# EAGLE design badge_spacehuhn (EAGLE 7.6.0)
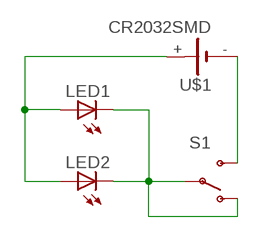
[diagram p0: schematic, sheet 1]

## Parts
LED1  LED5MM  [LED5MM]
LED2  LED5MM  [LED5MM]
S1  SWITCH-SPDT-SMD-A  [SWITCH-SPST-SMD-A]
U$1  CR2032SMD  [CR2032SMD]

## Nets
GND: LED1.K(C) LED2.K(C) S1.1(O) S1.2(P)
N$3: S1.3(S) U$1.-
VCC: LED1.A LED2.A U$1.+

## Library data of the parts
LED1 LED2 = led:LED: LED OSRAM: - CHIPLED LG R971, LG N971, LY N971, LG Q971, LY Q971, LO R971, LY R971 LH N974, LH R974 LS Q976, LO Q976, LY Q976 LO Q996 - Hyper CHIPLED LW Q18S LB Q993, LB Q99A, LB R99A - SideLED LS A670, LO A670, LY A670, LG A670, LP A670 LB A673, LV A673, LT A673, LW A673 LH A674 LY A675 LS A676, LA A676, LO A676, LY A676, LW A676 LS A679, LY A679, LG A679 - Hyper Micro SIDELED® LS Y876, LA Y876, LO Y876, LY Y876 LT Y87S - SmartLED LW L88C, LW L88S LB L89C, LB L89S, LG L890 LS L89K, LO L89K, LY L89K LS L896, LA L896, LO L896, LY L896 - TOPLED LS T670, LO T670, LY T670, LG T670, LP T670 LSG T670, LSP T670, LSY T670, LOP T670, LYG T670 LG T671, LOG T671, LSG T671 LB T673, LV T673, LT T673, LW T673 LH T674 LS T676, LA T676, LO T676, LY T676, LB T676, LH T676, LSB T676, LW T676 LB T67C, LV T67C, LT T67C, LS T67K, LO T67K, LY T67K, LW E67C LS E67B, LA E67B, LO E67B, LY E67B, LB E67C, LV E67C, LT E67C LW T67C LS T679, LY T679, LG T679 LS T770, LO T770, LY T770, LG T770, LP T770 LB T773, LV T773, LT T773, LW T773 LH T774 LS E675, LA E675, LY E675, LS T675 LS T776, LA T776, LO T776, LY T776, LB T776 LHGB T686 LT T68C, LB T68C - Hyper Mini TOPLED® LB M676 - Mini TOPLED Santana® LG M470 LS M47K, LO M47K, LY M47K Source: http://www.osram.convergy.de LUXEON: - LUMILED® LXK2-PW12-R00, LXK2-PW12-S00, LXK2-PW14-U00, LXK2-PW14-V00 LXK2-PM12-R00, LXK2-PM12-S00, LXK2-PM14-U00 LXK2-PE12-Q00, LXK2-PE12-R00, LXK2-PE12-S00, LXK2-PE14-T00, LXK2-PE14-U00 LXK2-PB12-K00, LXK2-PB12-L00, LXK2-PB12-M00, LXK2-PB14-N00, LXK2-PB14-P00, LXK2-PB14-Q00 LXK2-PR12-L00, LXK2-PR12-M00, LXK2-PR14-Q00, LXK2-PR14-R00 LXK2-PD12-Q00, LXK2-PD12-R00, LXK2-PD12-S00 LXK2-PH12-R00, LXK2-PH12-S00 LXK2-PL12-P00, LXK2-PL12-Q00, LXK2-PL12-R00 Source: www.luxeon.com KINGBRIGHT: KA-3528ASYC Source: www.kingbright.com
S1 = SparkFun-Electromechanical:SWITCH-SPDT: SPDT Switch Simple slide switch, Spark Fun Electronics SKU : COM-00102 DPDT SMT slide switch, AYZ0202, SWCH-08179
U$1 = battery:CR2032SMD

## Board
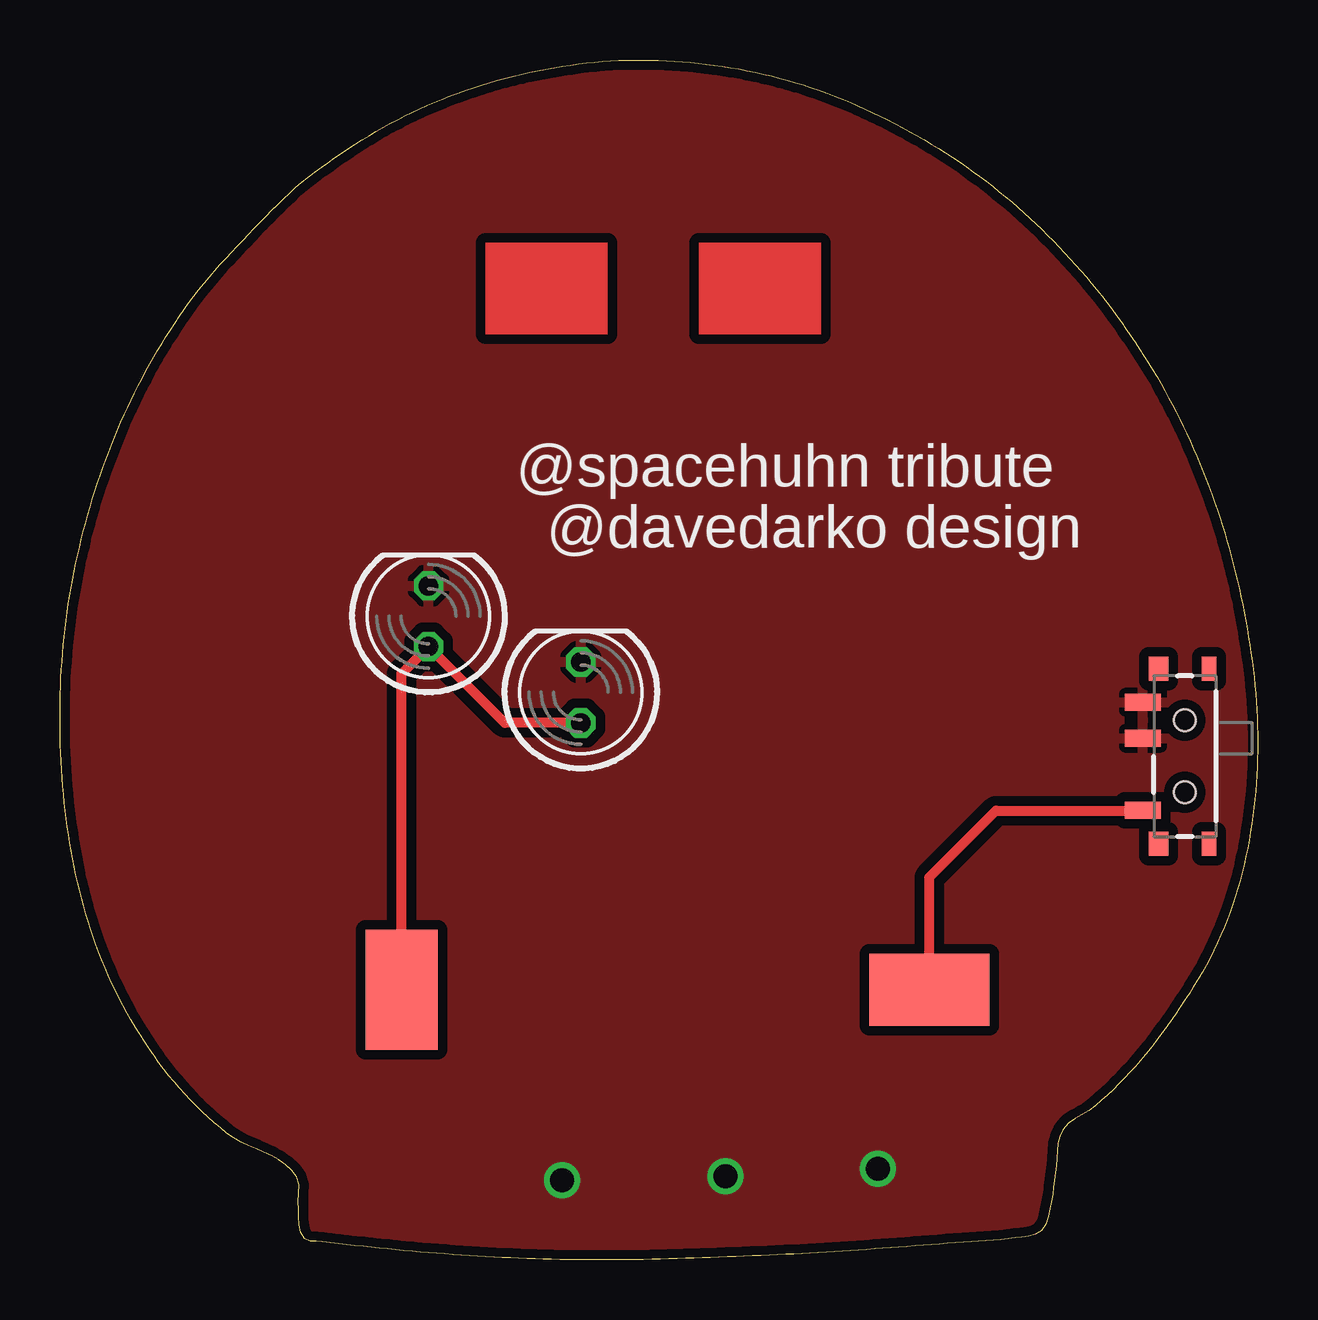
[diagram p1: board, top side]
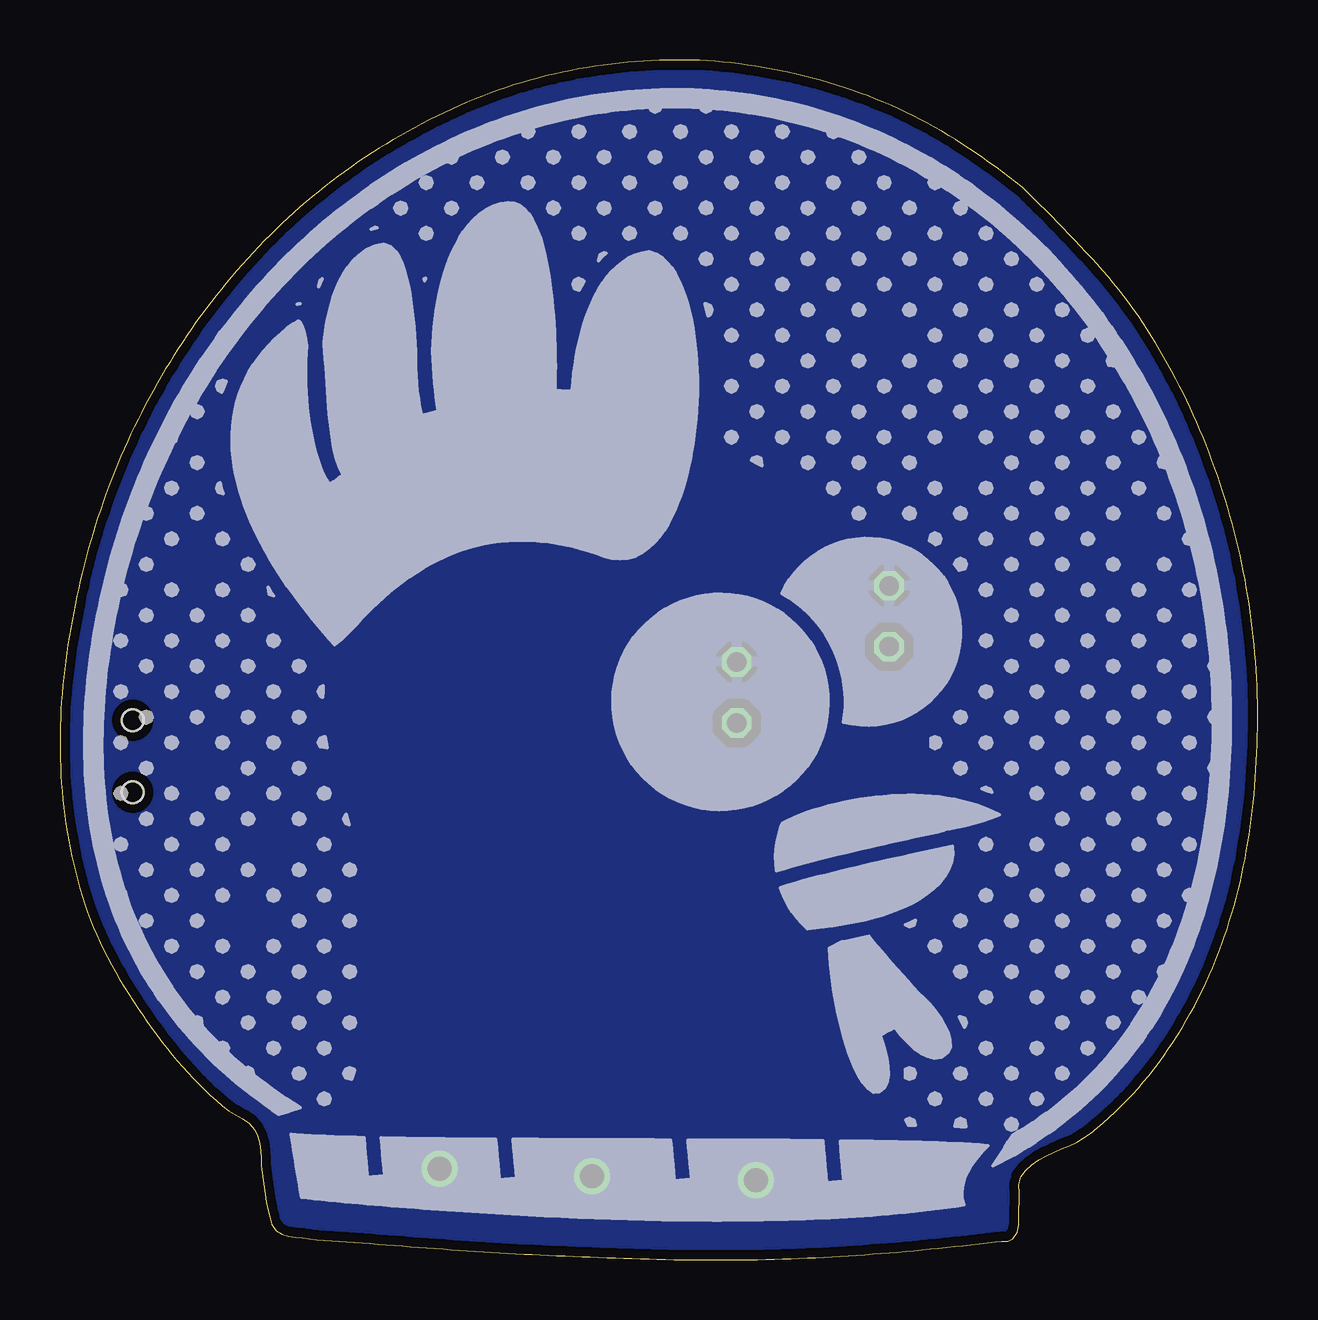
[diagram p2: board, bottom side, seen from below]

Size 49.92 x 50 mm. Coordinates in mm from the lower left corner, seen from the top.
Outline: 9.81,44.7 10.08,44.91 10.35,45.12 10.62,45.32 10.9,45.52 11.17,45.72 11.45,45.92 11.73,46.11 12.02,46.3 12.3,46.49 12.59,46.67 12.88,46.85 13.17,47.02 13.47,47.19 13.76,47.36 14.06,47.52 14.37,47.67 14.67,47.82 14.98,47.97 15.29,48.11 15.61,48.24 15.93,48.37 16.25,48.5 16.58,48.62 16.9,48.74 17.23,48.85 17.56,48.95 17.89,49.05 18.23,49.15 18.56,49.24 18.9,49.33 19.23,49.41 19.57,49.48 19.91,49.55 20.25,49.62 20.59,49.68 20.93,49.74 21.27,49.79 21.62,49.84 21.95,49.88 22.28,49.91 22.61,49.94 22.94,49.96 23.28,49.98 23.61,49.99 23.94,50 24.28,50 24.61,50 24.94,49.99 25.27,49.97 25.61,49.95 25.94,49.93 26.27,49.9 26.6,49.87 26.94,49.83 27.27,49.79 27.61,49.74 27.95,49.68 28.3,49.62 28.64,49.56 28.98,49.49 29.32,49.42 29.66,49.33 30,49.25 30.33,49.16 30.67,49.06 31,48.96 31.33,48.85 31.66,48.74 31.99,48.62 32.31,48.49 32.63,48.36 32.95,48.23 33.27,48.09 33.58,47.95 33.9,47.8 34.21,47.65 34.52,47.5 34.82,47.34 35.13,47.18 35.43,47.02 35.73,46.85 36.03,46.67 36.33,46.5 36.62,46.32 36.91,46.13 37.2,45.94 37.49,45.75 37.77,45.55 38.05,45.35 38.33,45.15 38.61,44.94 38.88,44.73 39.14,44.52 39.41,44.3 39.67,44.09 39.92,43.86 40.18,43.64 40.43,43.41 40.68,43.18 40.92,42.94 41.16,42.7 41.4,42.46 41.64,42.22 41.87,41.97 42.1,41.72 42.33,41.47 42.55,41.22 42.78,40.96 42.99,40.7 43.21,40.43 43.42,40.17 43.63,39.9 43.84,39.63 44.04,39.36 44.24,39.08 44.43,38.81 44.62,38.53 44.81,38.25 45,37.97 45.18,37.68 45.36,37.39 45.54,37.1 45.71,36.81 45.88,36.52 46.04,36.23 46.21,35.93 46.37,35.63 46.52,35.33 46.67,35.03 46.82,34.72 46.97,34.42 47.11,34.11 47.25,33.8 47.38,33.49 47.52,33.18 47.64,32.87 47.77,32.55 47.89,32.23 48.01,31.91 48.12,31.59 48.24,31.27 48.34,30.94 48.45,30.62 48.55,30.29 48.64,29.97 48.74,29.64 48.83,29.31 48.91,28.98 49,28.64 49.07,28.31 49.15,27.98 49.22,27.65 49.29,27.31 49.36,26.98 49.42,26.64 49.48,26.3 49.54,25.97 49.59,25.63 49.64,25.29 49.69,24.95 49.73,24.62 49.77,24.28 49.81,23.94 49.84,23.6 49.86,23.26 49.88,22.92 49.9,22.58 49.91,22.24 49.92,21.9 49.92,21.56 49.92,21.23 49.91,20.89 49.9,20.55 49.88,20.21 49.86,19.87 49.83,19.53 49.8,19.19 49.76,18.85 49.72,18.51 49.67,18.17 49.62,17.83 49.56,17.49 49.5,17.16 49.43,16.82 49.36,16.48 49.28,16.15 49.19,15.82 49.1,15.49 49,15.16 48.89,14.83 48.78,14.51 48.66,14.19 48.53,13.87 48.39,13.55 48.25,13.23 48.1,12.91 47.94,12.6 47.77,12.29 47.6,11.99 47.43,11.68 47.25,11.38 47.06,11.09 46.87,10.79 46.68,10.5 46.48,10.21 46.28,9.93 46.08,9.64 45.87,9.36 45.66,9.08 45.46,8.82 45.25,8.56 45.04,8.31 44.82,8.06 44.59,7.81 44.37,7.57 44.13,7.34 43.9,7.1 43.66,6.87 43.41,6.65 43.17,6.43 42.89,6.23 42.6,6.06 42.3,5.89 42.03,5.69 41.81,5.44 41.68,5.16 41.6,4.86 41.57,4.55 41.55,4.24 41.53,3.93 41.49,3.63 41.45,3.33 41.42,3.03 41.38,2.73 41.33,2.43 41.27,2.14 41.19,1.82 41.09,1.5 40.9,1.23 40.66,1.08 40.39,0.99 40.1,0.95 39.82,0.93 39.53,0.89 39.22,0.85 38.91,0.82 38.6,0.8 38.29,0.78 37.98,0.76 37.67,0.74 37.33,0.71 36.99,0.69 36.66,0.66 36.32,0.64 35.98,0.61 35.65,0.58 35.31,0.56 34.97,0.53 34.64,0.51 34.3,0.48 33.96,0.46 33.62,0.43 33.29,0.41 32.95,0.39 32.61,0.36 32.28,0.34 31.94,0.32 31.6,0.3 31.26,0.28 30.93,0.26 30.59,0.25 30.25,0.23 29.91,0.21 29.56,0.2 29.22,0.18 28.87,0.17 28.52,0.16 28.17,0.14 27.82,0.13 27.47,0.11 27.12,0.1 26.77,0.09 26.43,0.08 26.08,0.06 25.73,0.05 25.38,0.04 25.03,0.03 24.68,0.03 24.33,0.02 23.98,0.01 23.63,0.01 23.29,0 22.94,0 22.59,0 22.24,0 21.89,0 21.54,0 21.19,0.01 20.84,0.01 20.49,0.02 20.14,0.03 19.8,0.04 19.46,0.06 19.12,0.07 18.77,0.08 18.43,0.1 18.09,0.12 17.75,0.14 17.41,0.16 17.06,0.18 16.72,0.2 16.38,0.23 16.04,0.25 15.7,0.28 15.35,0.3 15.01,0.33 14.67,0.36 14.33,0.39 13.99,0.43 13.65,0.46 13.31,0.49 12.97,0.53 12.63,0.57 12.29,0.6 11.95,0.64 11.61,0.68 11.27,0.72 10.92,0.76 10.67,0.77 10.42,0.78 10.2,0.89 10.03,1.16 9.96,1.47 9.95,1.79 9.95,2.11 9.94,2.44 9.94,2.78 9.96,3.13 9.87,3.46 9.66,3.74 9.41,3.97 9.12,4.17 8.81,4.34 8.5,4.49 8.18,4.62 7.86,4.76 7.54,4.92 7.24,5.09 6.95,5.29 6.69,5.5 6.43,5.73 6.18,5.95 5.93,6.19 5.68,6.42 5.44,6.66 5.21,6.91 4.98,7.16 4.76,7.42 4.54,7.68 4.33,7.95 4.12,8.22 3.92,8.51 3.72,8.79 3.52,9.09 3.33,9.38 3.15,9.68 2.97,9.98 2.8,10.29 2.63,10.6 2.47,10.91 2.31,11.22 2.16,11.54 2.02,11.86 1.88,12.18 1.74,12.51 1.61,12.83 1.5,13.15 1.38,13.46 1.28,13.78 1.17,14.1 1.08,14.43 0.98,14.75 0.9,15.07 0.81,15.4 0.73,15.73 0.66,16.06 0.59,16.38 0.53,16.71 0.47,17.05 0.41,17.38 0.36,17.71 0.31,18.04 0.26,18.38 0.22,18.71 0.19,19.06 0.15,19.4 0.12,19.74 0.09,20.09 0.07,20.44 0.05,20.78 0.03,21.13 0.02,21.47 0.01,21.82 0,22.16 0,22.51 0,22.86 0.01,23.2 0.01,23.55 0.03,23.9 0.04,24.24 0.06,24.59 0.08,24.93 0.11,25.28 0.14,25.62 0.18,25.97 0.21,26.31 0.26,26.65 0.3,26.99 0.35,27.34 0.41,27.67 0.47,28.01 0.53,28.35 0.59,28.69 0.66,29.03 0.74,29.36 0.81,29.7 0.89,30.03 0.98,30.37 1.07,30.7 1.16,31.03 1.25,31.36 1.35,31.69 1.46,32.02 1.56,32.35 1.67,32.67 1.79,33 1.9,33.32 2.02,33.64 2.15,33.96 2.27,34.28 2.4,34.59 2.54,34.9 2.67,35.21 2.82,35.52 2.96,35.82 3.11,36.12 3.26,36.43 3.42,36.73 3.58,37.02 3.74,37.32 3.91,37.62 4.08,37.91 4.25,38.2 4.43,38.48 4.61,38.77 4.79,39.05 4.98,39.33 5.17,39.61 5.37,39.89 5.58,40.17 5.79,40.44 6.01,40.7 6.23,40.97 6.46,41.23 6.69,41.48 6.92,41.74 7.15,41.99 7.39,42.25 7.63,42.5 7.86,42.75 8.1,42.99 8.34,43.24 8.59,43.49 8.83,43.73 9.07,43.97 9.32,44.22 9.57,44.46 9.81,44.7
Copper layers (1*16): Top 0.0356mm / dielectric 1.5011mm / Bottom 0.0356mm
Design rules "LaenPCBOrder": minimum track width 6mil, minimum drill 13mil, track to track 6mil, track to pad 6mil, pad to pad 6mil, via to via 6mil, smd to smd 6mil, copper to edge 15mil, drill to drill 6mil, minimum pad ring 7mil, minimum via ring 7mil, stop-mask expansion 3mil, vias tented up to drill 0mil, thermal gap 10mil

### Footprints (pad centres in the part's own frame; a part is rotated, then mirrored left to right if it is on the bottom)
LED5MM = drill 0.813 octagon: A -1.27,0; K 1.27,0
SWITCH-SPST-SMD-A = smd 0.7 x 1.5: 1 -2.25,-1.75; 2 -0.75,-1.75; 3 2.25,-1.75 | smd 1 x 0.6: GND1 -3.65,1; GND3 3.65,1 | smd 1 x 0.8: GND2 -3.65,-1.1; GND4 3.65,-1.1 | hole 0.9: -1.5,0; 1.5,0
CR2032SMD = smd 5 x 3: + 0,-11 | smd 3 x 5: - 0,11

### Placement (x,y rotation side)
LED1  21.71,23.65 90 top
LED2  15.36,26.82 90 top
S1  46.89,20.99 270 top
U$1  25.24,11.26 270 top
U$2  [DAVEDARKO_GOLD]  7.58,18.25 0 top

### Tracks (layer width: path | path; a pad name or v marks a point on that pad's centre or on a via)
GND  (via drill 1)
  other vias: 20.92,3.33 27.74,3.49 34.09,3.8
  pour Top (isolate 0.406): -1.31,50 49.49,50 49.49,-0.8 -1.31,-0.8
  pour Bottom (isolate 0.406): -3.85,51.27 52.03,51.27 52.03,-2.07 -3.85,-2.07
N$3
  Top 0.406: U$1.- 36.23,15.95 39.01,18.73 45.13,18.73 S1.3
VCC
  Top 0.406: U$1.+ 14.23,24.43 LED2.A 18.54,22.38 LED1.A
(copper drawn outside any net)
  shapes: Top area x2

### Text on the board
tNames: @spacehuhn tribute | @davedarko design